# EAGLE design DigitalesSCH (EAGLE 9.6.2)
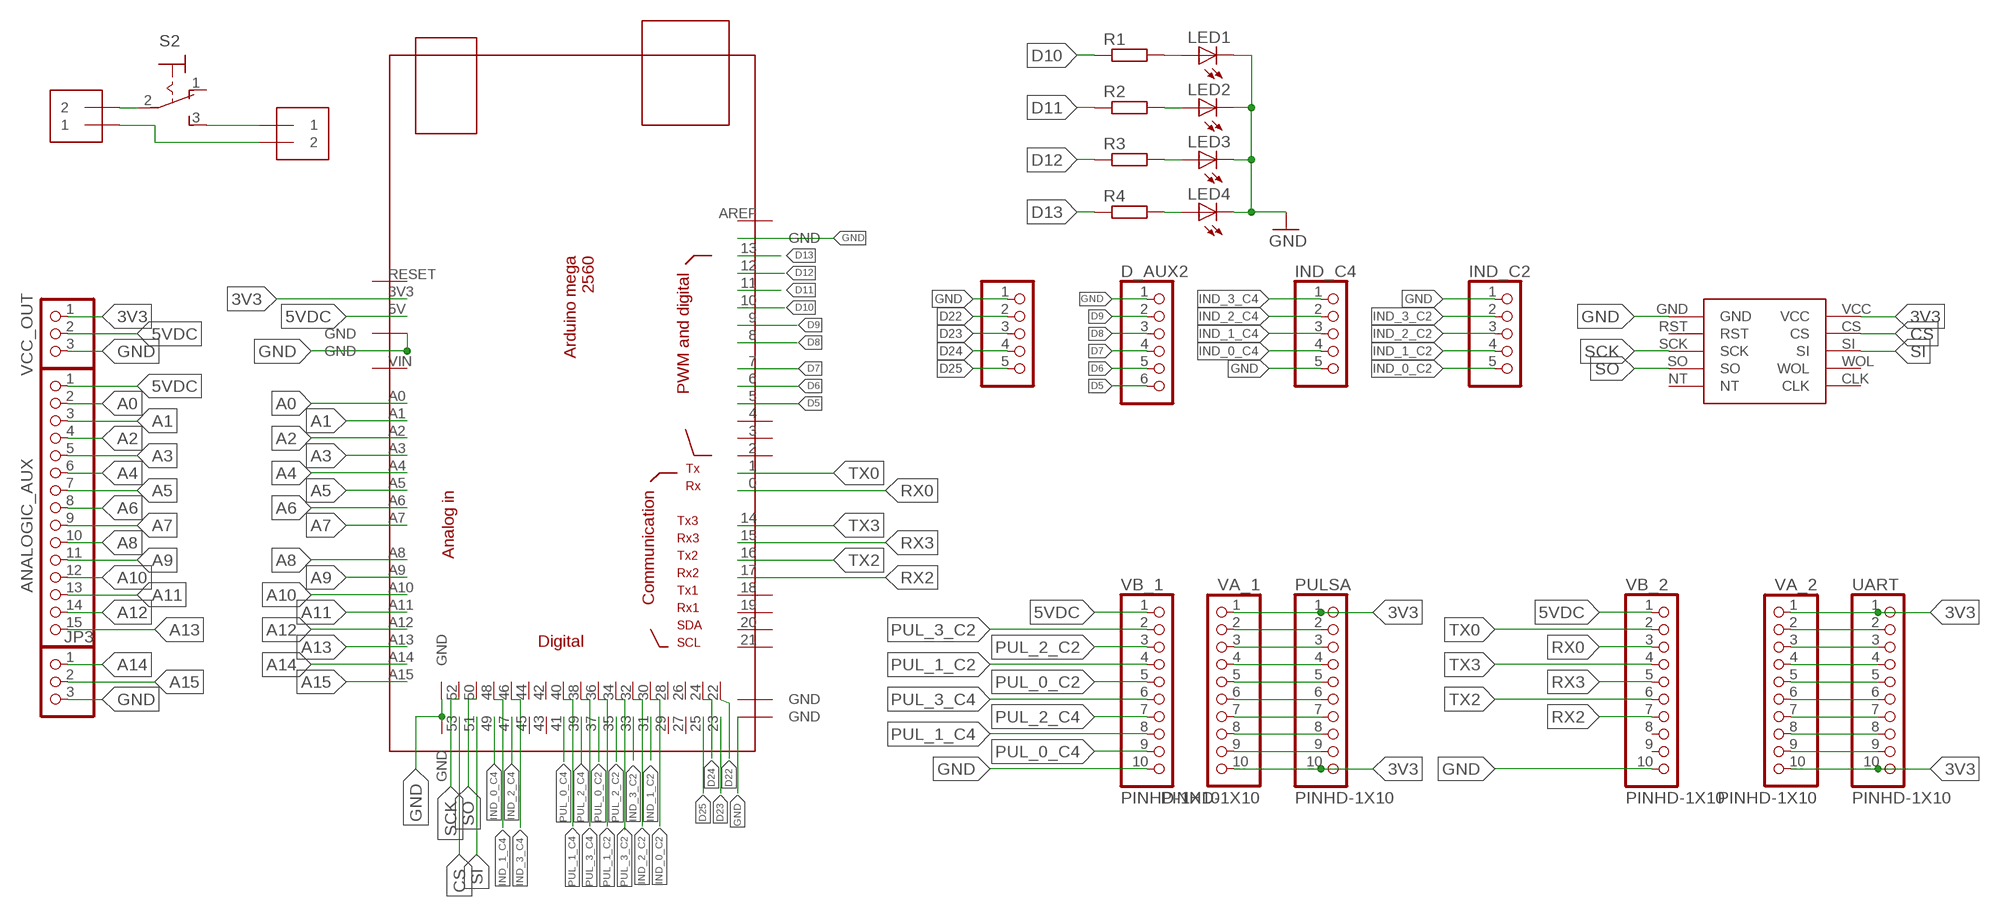
[diagram p0: schematic, sheet 1]

## Parts
ANALOGIC_AUX  PINHD-1X15  [1X15]
D_AUX1  PINHD-1X5  [1X05]
D_AUX2  PINHD-1X6  [1X06]
IND_C2  PINHD-1X5  [1X05]
IND_C4  PINHD-1X5  [1X05]
JP3  PINHD-1X3  [1X03]
LED1  LED3MM  [LED3MM]
LED2  LED3MM  [LED3MM]
LED3  LED3MM  [LED3MM]
LED4  LED3MM  [LED3MM]
PULSA  PINHD-1X10  [1X10-BIG]
R1  R-EU_M1206  [M1206]
R2  R-EU_M1206  [M1206]
R3  R-EU_M1206  [M1206]
R4  R-EU_M1206  [M1206]
S2  M9040P  [M9040P]
U$1  MEGA_DEVICE  [MEGAOUTLINE]
U$2  ENC28J60  [ENC28J60]
UART  PINHD-1X10  [1X10-BIG]
VA_1  PINHD-1X10  [1X10-BIG]
VA_2  PINHD-1X10  [1X10-BIG]
VB_1  PINHD-1X10  [1X10-BIG]
VB_2  PINHD-1X10  [1X10-BIG]
VCC_OUT  PINHD-1X3  [1X03]
VIN  1X2-3.5MM  [1X2-3.5MM]
VOUT  1X2-3.5MM  [1X2-3.5MM]

## Nets
3V3: PULSA.1 PULSA.10 U$1.3V3 U$2.VCC UART.1 UART.10 VA_1.1 VA_1.10 VA_2.1 VA_2.10 VCC_OUT.1
5VDC: ANALOGIC_AUX.1 U$1.5V VB_1.1 VB_2.1 VCC_OUT.2
A0: ANALOGIC_AUX.2 U$1.A0
A1: ANALOGIC_AUX.3 U$1.A1
A2: ANALOGIC_AUX.4 U$1.A2
A3: ANALOGIC_AUX.5 U$1.A3
A4: ANALOGIC_AUX.6 U$1.A4
A5: ANALOGIC_AUX.7 U$1.A5
A6: ANALOGIC_AUX.8 U$1.A6
A7: ANALOGIC_AUX.9 U$1.A7
A8: ANALOGIC_AUX.10 U$1.A8
A9: ANALOGIC_AUX.11 U$1.A9
A10: ANALOGIC_AUX.12 U$1.A10
A11: ANALOGIC_AUX.13 U$1.A11
A12: ANALOGIC_AUX.14 U$1.A12
A13: ANALOGIC_AUX.15 U$1.A13
A14: JP3.1 U$1.A14
A15: JP3.2 U$1.A15
CS: U$1.53 U$2.CS
D5: D_AUX2.6 U$1.5
D6: D_AUX2.5 U$1.6
D7: D_AUX2.4 U$1.7
D8: D_AUX2.3 U$1.8
D9: D_AUX2.2 U$1.9
D10: R1.1 U$1.10
D11: R2.1 U$1.11
D12: R3.1 U$1.12
D13: R4.1 U$1.13
D22: D_AUX1.2 U$1.22
D23: D_AUX1.3 U$1.23
D24: D_AUX1.4 U$1.24
D25: D_AUX1.5 U$1.25
GND: D_AUX1.1 D_AUX2.1 IND_C2.1 IND_C4.5 JP3.3 LED1.K(C) LED2.K(C) LED3.K(C) LED4.K(C) U$1.GND@1(GND) U$1.GND@2(GND) U$1.GND@3(GND) U$1.GND@5(GND) U$1.GND@6(GND) U$1.GND@7(GND) U$2.GND VB_1.10 VB_2.10 VCC_OUT.3
IND_0_C2: IND_C2.5 U$1.30
IND_0_C4: IND_C4.4 U$1.49
IND_1_C2: IND_C2.4 U$1.31
IND_1_C4: IND_C4.3 U$1.48
IND_2_C2: IND_C2.3 U$1.32
IND_2_C4: IND_C4.2 U$1.47
IND_3_C2: IND_C2.2 U$1.33
IND_3_C4: IND_C4.1 U$1.46
N$1: LED1.A R1.2
N$2: LED2.A R2.2
N$3: LED3.A R3.2
N$4: LED4.A R4.2
N$5: S2.2(P) VIN.2
N$6: PULSA.2 VA_1.2
N$7: PULSA.3 VA_1.3
N$8: PULSA.4 VA_1.4
N$9: PULSA.5 VA_1.5
N$10: PULSA.6 VA_1.6
N$11: PULSA.7 VA_1.7
N$12: PULSA.8 VA_1.8
N$13: PULSA.9 VA_1.9
N$14: S2.3(S) VOUT.1
N$15: VIN.1 VOUT.2
N$16: UART.2 VA_2.2
N$17: UART.3 VA_2.3
N$18: UART.4 VA_2.4
N$19: UART.5 VA_2.5
N$20: UART.6 VA_2.6
N$21: UART.7 VA_2.7
N$22: UART.8 VA_2.8
N$23: UART.9 VA_2.9
PUL_0_C2: U$1.37 VB_1.5
PUL_0_C4: U$1.41 VB_1.9
PUL_1_C2: U$1.36 VB_1.4
PUL_1_C4: U$1.40 VB_1.8
PUL_2_C2: U$1.35 VB_1.3
PUL_2_C4: U$1.39 VB_1.7
PUL_3_C2: U$1.34 VB_1.2
PUL_3_C4: U$1.38 VB_1.6
RX0: U$1.0 VB_2.3
RX2: U$1.17 VB_2.7
RX3: U$1.15 VB_2.5
SCK: U$1.52 U$2.SCK
SI: U$1.51 U$2.SI
SO: U$1.50 U$2.SO
TX0: U$1.1 VB_2.2
TX2: U$1.16 VB_2.6
TX3: U$1.14 VB_2.4
Unconnected: S2.1(O) U$1.2 U$1.3 U$1.4 U$1.18 U$1.19 U$1.20 U$1.21 U$1.26 U$1.27 U$1.28 U$1.29 U$1.42 U$1.43 U$1.44 U$1.45 U$1.AREF U$1.GND@4(GND) U$1.RESET U$1.VIN U$2.CLK U$2.NT U$2.RST U$2.WOL VB_2.8 VB_2.9

## Library data of the parts
ANALOGIC_AUX = adafruit:PINHD-1X15: PIN HEADER
D_AUX1 IND_C2 IND_C4 = pinhead:PINHD-1X5: PIN HEADER
D_AUX2 = adafruit:PINHD-1X6: PIN HEADER
JP3 VCC_OUT = pinhead:PINHD-1X3: PIN HEADER
LED1-LED4 = adafruit:LED: LED OSRAM: - CHIPLED LG R971, LG N971, LY N971, LG Q971, LY Q971, LO R971, LY R971 LH N974, LH R974 LS Q976, LO Q976, LY Q976 LO Q996 - Hyper CHIPLED LW Q18S LB Q993, LB Q99A, LB R99A - SideLED LS A670, LO A670, LY A670, LG A670, LP A670 LB A673, LV A673, LT A673, LW A673 LH A674 LY A675 LS A676, LA A676, LO A676, LY A676, LW A676 LS A679, LY A679, LG A679 - Hyper Micro SIDELED® LS Y876, LA Y876, LO Y876, LY Y876 LT Y87S - SmartLED LW L88C, LW L88S LB L89C, LB L89S, LG L890 LS L89K, LO L89K, LY L89K LS L896, LA L896, LO L896, LY L896 - TOPLED LS T670, LO T670, LY T670, LG T670, LP T670 LSG T670, LSP T670, LSY T670, LOP T670, LYG T670 LG T671, LOG T671, LSG T671 LB T673, LV T673, LT T673, LW T673 LH T674 LS T676, LA T676, LO T676, LY T676, LB T676, LH T676, LSB T676, LW T676 LB T67C, LV T67C, LT T67C, LS T67K, LO T67K, LY T67K, LW E67C LS E67B, LA E67B, LO E67B, LY E67B, LB E67C, LV E67C, LT E67C LW T67C LS T679, LY T679, LG T679 LS T770, LO T770, LY T770, LG T770, LP T770 LB T773, LV T773, LT T773, LW T773 LH T774 LS E675, LA E675, LY E675, LS T675 LS T776, LA T776, LO T776, LY T776, LB T776 LHGB T686 LT T68C, LB T68C - Hyper Mini TOPLED® LB M676 - Mini TOPLED Santana® LG M470 LS M47K, LO M47K, LY M47K Source: http://www.osram.convergy.de/
PULSA UART VA_1 VA_2 VB_1 VB_2 = adafruit:PINHD-1X10: Pin header 1x10 0.1" spacing With round pins
R1-R4 = rcl:R-EU_: RESISTOR, European symbol; SPICEPREFIX: R
S2 = switch:M9040P: TOGGLE SWITCH Marquardt
U$1 = ArduinoMegaOutline:MEGA_DEVICE: mega card as device
U$2 = ethernet-mikroavr:ENC28J60: ENC28J60, SHIELD EHTERNET, CREATE BY MIKROAVR.COM
VIN VOUT = adafruit:1X2: 3.5mm Terminal block http://www.ladyada.net/library/pcb/eaglelibrary.html

## Net classes
0 default: clearance 0.205 mm

## Board
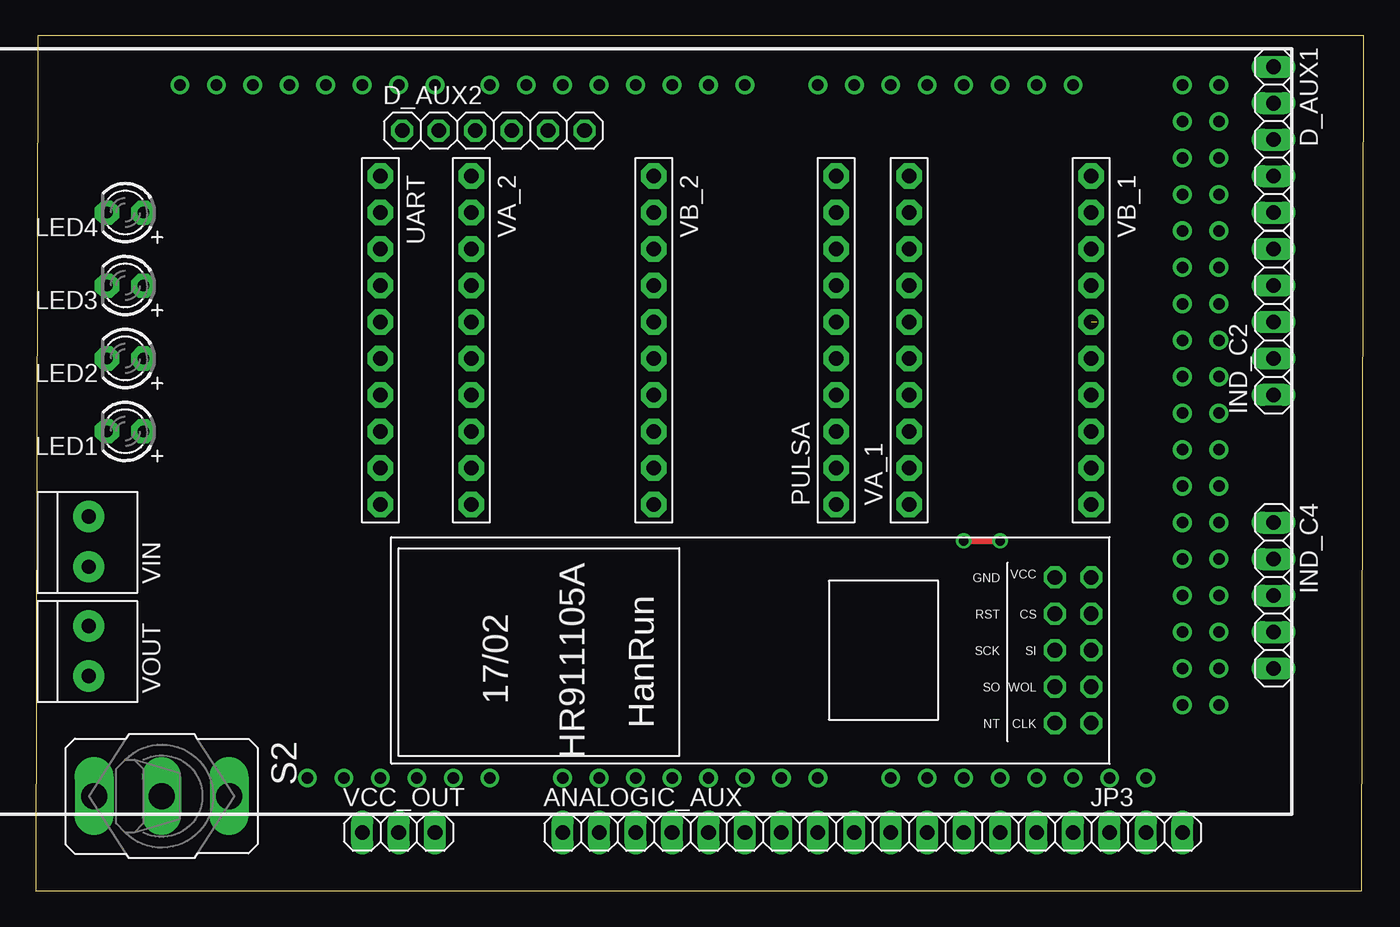
[diagram p1: board, top side]
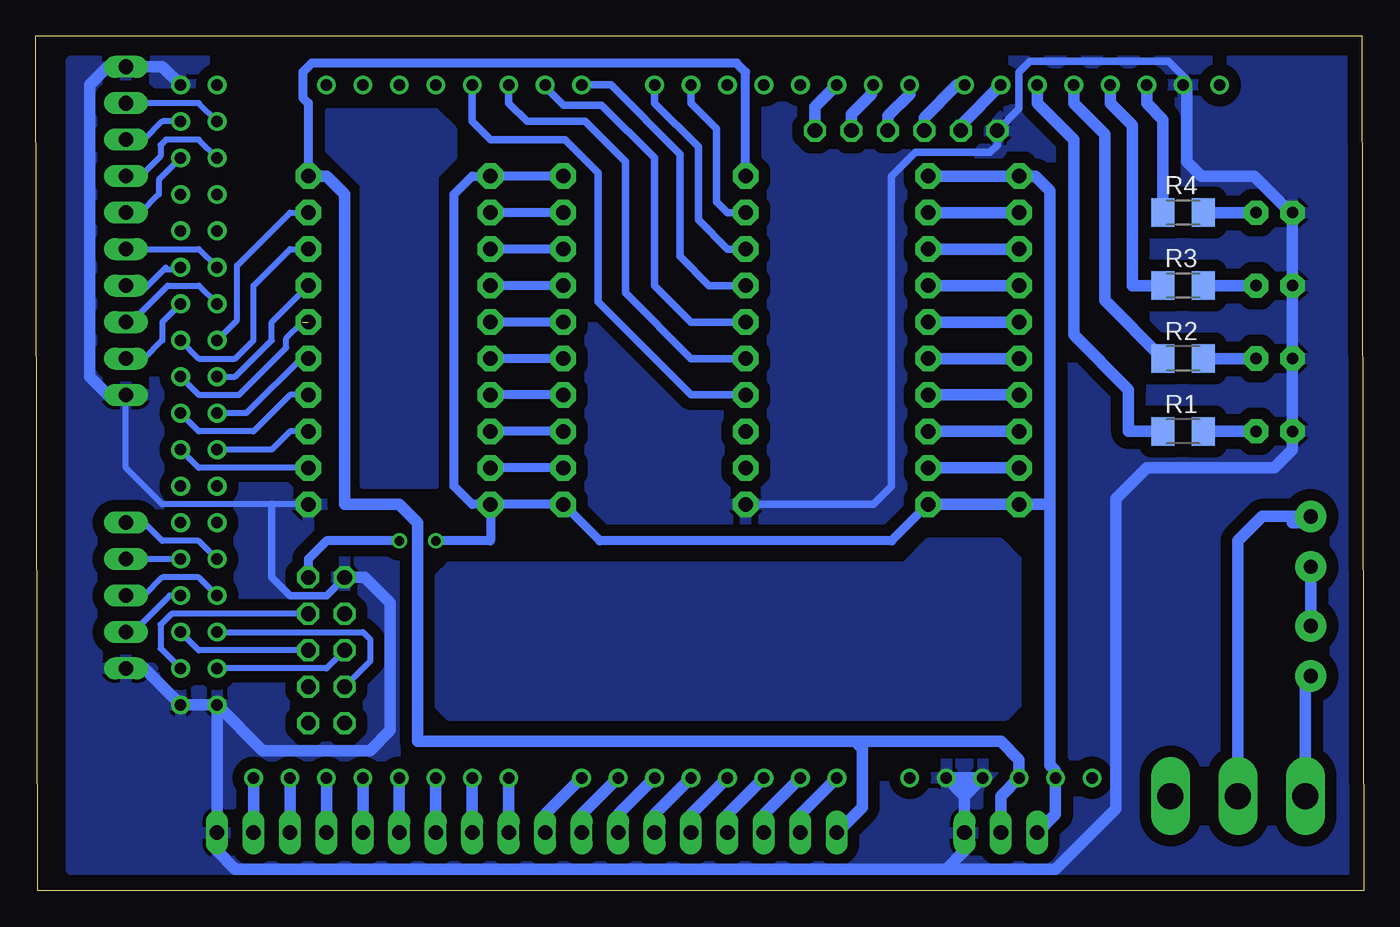
[diagram p2: board, bottom side, seen from below]

Size 92.51 x 59.55 mm. Coordinates in mm from the lower left corner, seen from the top.
Outline: 0,0 92.38,0 92.51,59.55 0.13,59.55 0,0
Copper layers (1*16): Top 0.035mm / dielectric 1.5mm / Bottom 0.035mm
Design rules "DigitalesSCH": minimum track width 6mil, minimum drill 0.35mm, track to track 0.205mm, track to pad 0.205mm, pad to pad 0.205mm, via to via 0.205mm, smd to smd 6mil, copper to edge 40mil, drill to drill 6mil, minimum pad ring 10mil, minimum via ring 8mil, stop-mask expansion 4mil, vias tented up to drill 0mil, thermal gap 10mil

### Footprints (pad centres in the part's own frame; a part is rotated, then mirrored left to right if it is on the bottom)
1X15 = drill 1.016 long: 1 -17.78,0; 2 -15.24,0; 3 -12.7,0; 4 -10.16,0; 5 -7.62,0; 6 -5.08,0; 7 -2.54,0; 8 0,0; 9 2.54,0; 10 5.08,0; 11 7.62,0; 12 10.16,0; 13 12.7,0; 14 15.24,0; 15 17.78,0
1X05 = drill 1.016 long: 1 -5.08,0; 2 -2.54,0; 3 0,0; 4 2.54,0; 5 5.08,0
1X06 = drill 1.016 octagon: 1 -6.35,0; 2 -3.81,0; 3 -1.27,0; 4 1.27,0; 5 3.81,0; 6 6.35,0
1X03 = drill 1.016 long: 1 -2.54,0; 2 0,0; 3 2.54,0
LED3MM = drill 0.813 pad 1.676 octagon: A -1.27,0; K 1.27,0
1X10-BIG = drill 1.016 pad 1.778 octagon: 1 -11.43,0; 2 -8.89,0; 3 -6.35,0; 4 -3.81,0; 5 -1.27,0; 6 1.27,0; 7 3.81,0; 8 6.35,0; 9 8.89,0; 10 11.43,0
M1206 = smd 1.6 x 2: 1 -1.4,0; 2 1.4,0
M9040P = drill 1.803 long: 1 0,4.699; 2 0,0; 3 0,-4.699
MEGAOUTLINE = drill 0.8: 0 12.7,24.13; 1 10.16,24.13; 2 7.62,24.13; 3 5.08,24.13; 3V3 -15.24,-24.13; 4 2.54,24.13; 5 0,24.13; 5V -12.7,-24.13; 6 -2.54,24.13; 7 -5.08,24.13; 8 -8.89,24.13; 9 -11.43,24.13; 10 -13.97,24.13; 11 -16.51,24.13; 12 -19.05,24.13; 13 -21.59,24.13; 14 17.78,24.13; 15 20.32,24.13; 16 22.86,24.13; 17 25.4,24.13; 18 27.94,24.13; 19 30.48,24.13; 20 33.02,24.13; 21 35.56,24.13; 22 43.18,21.59; 23 45.72,21.59; 24 43.18,19.05; 25 45.72,19.05; 26 43.18,16.51; 27 45.72,16.51; 28 43.18,13.97; 29 45.72,13.97; 30 43.18,11.43; 31 45.72,11.43; 32 43.18,8.89; 33 45.72,8.89; 34 43.18,6.35; 35 45.72,6.35; 36 43.18,3.81; 37 45.72,3.81; 38 43.18,1.27; 39 45.72,1.27; 40 43.18,-1.27; 41 45.72,-1.27; 42 43.18,-3.81; 43 45.72,-3.81; 44 43.18,-6.35; 45 45.72,-6.35; 46 43.18,-8.89; 47 45.72,-8.89; 48 43.18,-11.43; 49 45.72,-11.43; 50 43.18,-13.97; 51 45.72,-13.97; 52 43.18,-16.51; 53 45.72,-16.51; A0 0,-24.13; A1 2.54,-24.13; A2 5.08,-24.13; A3 7.62,-24.13; A4 10.16,-24.13; A5 12.7,-24.13; A6 15.24,-24.13; A7 17.78,-24.13; A8 22.86,-24.13; A9 25.4,-24.13; A10 27.94,-24.13; A11 30.48,-24.13; A12 33.02,-24.13; A13 35.56,-24.13; A14 38.1,-24.13; A15 40.64,-24.13; AREF -26.67,24.13; GND@1 -24.13,24.13; GND@2 -10.16,-24.13; GND@3 -7.62,-24.13; GND@4 43.18,24.13; GND@5 45.72,24.13; GND@6 43.18,-19.05; GND@7 45.72,-19.05; RESET -17.78,-24.13; VIN -5.08,-24.13
ENC28J60 = drill 1.016 octagon: CLK 1.27,2.54; CS 1.27,-5.08; GND 3.81,-7.62; NT 3.81,2.54; RST 3.81,-5.08; SCK 3.81,-2.54; SI 1.27,-2.54; SO 3.81,0; VCC 1.27,-7.62; WOL 1.27,0
1X2-3.5MM = drill 1 pad 2.184: 1 1.8,0; 2 -1.7,0

### Placement (x,y rotation side)
ANALOGIC_AUX  54.48,4.06 0 top
D_AUX1  86.23,52.32 270 top
D_AUX2  31.88,52.96 0 top
IND_C2  86.23,39.62 90 top
IND_C4  86.23,20.57 270 top
JP3  77.34,4.06 0 top
LED1  6.22,32 180 top
LED2  6.22,37.08 180 top
LED3  6.22,42.16 180 top
LED4  6.22,47.24 180 top
PULSA  55.75,38.35 90 top
R1  12.57,32 0 bottom
R2  12.57,37.08 0 bottom
R3  12.57,42.16 0 bottom
R4  12.57,47.24 0 bottom
S2  8.76,6.6 270 top
U$1  36.7,32 0 top
U$2  74.8,14.22 180 top
UART  24,38.35 270 top
VA_1  60.83,38.35 90 top
VA_2  30.35,38.35 270 top
VB_1  73.53,38.35 270 top
VB_2  43.05,38.35 270 top
VCC_OUT  25.27,4.06 0 top
VIN  3.68,24.38 270 top
VOUT  3.68,16.76 270 top

### Tracks (layer width: path | path; a pad name or v marks a point on that pad's centre or on a via)
3V3  (via drill 0.65 pad 0.55)
  Top 0.406: v64.64,24.38 v67.18,24.38
  Bottom 0.61: VA_2.10 32.89,24.38 53.21,24.38 PULSA.1 VA_1.1 | VA_1.1 62.1,26.92 63.37,28.19 63.37,48.51 62.1,49.78 VA_1.10 PULSA.10 | VA_1.1 60.83,24.38 v64.64,24.38 | U$2.VCC 73.53,23.11 72.26,24.38 v67.18,24.38
  Bottom 0.813: 21.84,26.92 21.84,48.77 22.86,49.78 UART.1 VA_2.1 | 21.84,26.92 21.84,8.76 21.46,8.38 U$1.3V3 21.46,5.33 VCC_OUT.1 | 21.84,26.92 UART.10 VA_2.10
5VDC
  Bottom 0.61: VB_2.1 43.05,57.02 43.69,57.66 73.28,57.66 73.91,57.02 73.91,55.25 73.53,54.86 VB_1.1
  Bottom 0.813: VCC_OUT.2 25.27,6.6 U$1.5V 24,9.14 25.27,10.41 35.43,10.41 | VB_1.1 72.26,49.78 70.99,48.51 70.99,26.92 67.18,26.92 65.91,25.65 65.91,10.41 35.43,10.41 | ANALOGIC_AUX.1 34.93,5.84 34.93,9.91 35.43,10.41
A0
  Bottom 0.813: U$1.A0 39.24,5.33 ANALOGIC_AUX.2
A1
  Bottom 0.813: U$1.A1 41.78,5.33 ANALOGIC_AUX.3
A2
  Bottom 0.813: U$1.A2 44.32,5.33 ANALOGIC_AUX.4
A3
  Bottom 0.813: U$1.A3 46.86,5.33 ANALOGIC_AUX.5
A4
  Bottom 0.813: U$1.A4 49.4,5.33 ANALOGIC_AUX.6
A5
  Bottom 0.813: U$1.A5 51.94,5.33 ANALOGIC_AUX.7
A6
  Bottom 0.813: U$1.A6 54.48,5.33 ANALOGIC_AUX.8
A7
  Bottom 0.813: U$1.A7 57.02,5.33 ANALOGIC_AUX.9
A8
  Bottom 0.813: U$1.A8 ANALOGIC_AUX.10
A9
  Bottom 0.813: U$1.A9 ANALOGIC_AUX.11
A10
  Bottom 0.813: U$1.A10 ANALOGIC_AUX.12
A11
  Bottom 0.813: U$1.A11 ANALOGIC_AUX.13
A12
  Bottom 0.813: U$1.A12 ANALOGIC_AUX.14
A13
  Bottom 0.813: U$1.A13 ANALOGIC_AUX.15
A14
  Bottom 0.813: U$1.A14 JP3.1
A15
  Bottom 0.813: U$1.A15 JP3.2
AA0
  pour Bottom: 24,12.95 24,23.11 25.27,24.38 30.35,24.38 32,22.73 63.75,22.73 64.52,21.97 64.52,12.83 63.75,12.06 24.89,12.06
AA1
  pour Bottom: 64.64,28.19 69.72,28.19 69.72,48.51 69.72,49.15 72.14,51.56 72.14,54.36 64.64,54.36 63.37,53.09 63.37,51.05 64.64,49.78
CS
  Bottom 0.406: U$1.53 83.82,16.89 83.82,18.54 83.06,19.3 U$2.CS
D5
  Bottom 0.813: U$1.5 38.23,54.61 D_AUX2.6
D6
  Bottom 0.813: U$1.6 34.29,56.01 34.29,55.5 35.69,54.1 D_AUX2.5
D7
  Bottom 0.813: D_AUX2.4 33.15,53.98 31.62,55.5 U$1.7
D8
  Bottom 0.813: U$1.8 28.32,56.13 30.61,53.85 D_AUX2.3
D9
  Bottom 0.813: U$1.9 28.07,53.34 D_AUX2.2
D10
  Bottom 0.813: R1.1 16.38,32 16.38,34.93 20.19,38.73 20.19,52.32 22.73,54.86 U$1.10
D11
  Bottom 0.813: R2.1 18.03,41.15 18.03,52.7 20.19,54.86 U$1.11
D12
  Bottom 0.813: R3.1 16.13,42.16 16.13,53.34 17.65,54.86 U$1.12
D13
  Bottom 0.813: R4.1 13.97,53.72 15.11,54.86 U$1.13
D22
  Bottom 0.406: U$1.22 81.15,54.86 D_AUX1.2
D23
  Bottom 0.406: U$1.23 83.69,53.59 84.96,52.32 D_AUX1.3
D24
  Bottom 0.406: U$1.24 81.15,52.32 83.44,52.32 83.82,51.94 83.82,51.18 85.22,49.78 D_AUX1.4
D25
  Bottom 0.406: D_AUX1.5 85.22,47.24 83.95,48.51 83.95,49.53 U$1.25
GND
  Bottom 0.406: VB_1.10 76.07,26.92 83.69,26.92 86.23,29.46 IND_C2.1
  Bottom 0.508: U$2.GND 72.26,20.57 74.8,20.57 76.07,21.84 76.07,26.92 | VB_2.10 34.16,26.92 32.89,28.19 32.89,49.78 31.24,51.44 26.04,51.44 25.53,51.94 D_AUX2.1 24,54.48 24,57.02 23.24,57.79 13.59,57.79 12.32,56.52 12.32,55.88
  Bottom 0.813: VCC_OUT.3 27.81,5.33 | 27.81,7.87 U$1.GND@2 27.81,6.6 | 27.81,7.87 U$1.GND@3 27.81,6.6 | VCC_OUT.3 27.81,6.6 | 27.81,6.6 27.81,7.87 | U$2.GND 69.6,21.84 67.82,20.07 67.82,11.18 69.22,9.78 76.71,9.78 U$1.GND@6 | U$1.GND@6 U$1.GND@7 84.96,15.49 IND_C4.5 | U$1.GND@6 JP3.3 79.88,2.79 78.61,1.52 29.08,1.52 | VCC_OUT.3 27.81,2.79 29.08,1.52 | U$1.GND@1 12.32,55.88 12.32,50.8 11.3,49.78 7.62,49.78 5.08,47.24 LED4.K LED3.K LED2.K LED1.K 4.95,30.73 6.22,29.46 15.11,29.46 17.27,27.3 17.27,5.71 21.46,1.52 29.08,1.52 | IND_C2.1 87.5,34.54 88.77,35.81 88.77,56.13 87.5,57.4 D_AUX1.1 83.69,57.4 U$1.GND@5
  pour Bottom (isolate 0.813): 1.14,57.79 90.04,57.79 90.04,1.52 1.14,1.52
IND_0_C2
  Bottom 0.406: IND_C2.5 81.15,44.7 U$1.30
IND_0_C4
  Bottom 0.406: IND_C4.4 85.73,18.03 83.19,20.57 U$1.49
IND_1_C2
  Bottom 0.406: 83.44,43.43 83.57,43.31 | 83.57,43.31 84.84,42.04 86.11,42.04 IND_C2.4 | 83.57,43.31 82.55,43.31 U$1.31
IND_1_C4
  Bottom 0.406: IND_C4.3 84.96,20.57 83.69,21.84 81.15,21.84 U$1.48
IND_2_C2
  Bottom 0.406: IND_C2.3 85.6,39.62 85.6,39.88 83.31,42.16 81.15,42.16 U$1.32
IND_2_C4
  Bottom 0.406: U$1.47 IND_C4.2
IND_3_C2
  Bottom 0.406: IND_C2.2 84.96,37.08 83.69,38.35 83.69,39.62 U$1.33
IND_3_C4
  Bottom 0.406: IND_C4.1 84.96,25.65 83.69,24.38 81.15,24.38 U$1.46
N$1
  Bottom 0.813: R1.2 LED1.A
N$2
  Bottom 0.813: R2.2 LED2.A
N$3
  Bottom 0.813: R3.2 LED3.A
N$4
  Bottom 0.813: R4.2 LED4.A
N$5
  Bottom 0.813: 4.95,25.65 4.11,25.65 VIN.2 7.06,26.08 8.76,24.38 S2.2
N$6
  Bottom 0.61: PULSA.2 VA_1.2
N$7
  Bottom 0.61: PULSA.3 VA_1.3
N$8
  Bottom 0.61: PULSA.4 VA_1.4
N$9
  Bottom 0.61: PULSA.5 VA_1.5
N$10
  Bottom 0.61: PULSA.6 VA_1.6
N$11
  Bottom 0.61: PULSA.7 VA_1.7
N$12
  Bottom 0.61: PULSA.8 VA_1.8
N$13
  Bottom 0.61: PULSA.9 VA_1.9
N$14
  Bottom 0.813: VOUT.1 4.06,14.58 S2.3
N$15
  Bottom 0.813: VIN.1 VOUT.2
N$16
  Bottom 0.813: UART.2 VA_2.2
N$17
  Bottom 0.813: UART.3 VA_2.3
N$18
  Bottom 0.813: UART.4 VA_2.4
N$19
  Bottom 0.813: UART.5 VA_2.5
N$20
  Bottom 0.813: UART.6 VA_2.6
N$21
  Bottom 0.813: UART.7 VA_2.7
N$22
  Bottom 0.813: UART.8 VA_2.8
N$23
  Bottom 0.813: UART.9 VA_2.9
PUL_0_C2  (1 unrouted)
  Bottom 0.406: U$1.37 81.15,34.54 78.36,34.54 75.06,37.85 75.06,38.48 73.91,39.62
PUL_0_C4
  Bottom 0.406: VB_1.9 81.15,29.46 U$1.41
PUL_1_C2
  Bottom 0.406: U$1.36 78.61,35.81 76.07,38.35 76.07,39.62 VB_1.4
PUL_1_C4
  Bottom 0.406: VB_1.8 74.8,32 76.07,30.73 U$1.40
PUL_2_C2
  Bottom 0.406: U$1.35 81.15,37.08 78.61,37.08 77.34,38.35 77.34,42.16 74.8,44.7 VB_1.3
PUL_2_C4
  Bottom 0.406: VB_1.7 74.8,34.54 77.34,32 81.15,32 U$1.39
PUL_3_C2
  Bottom 0.406: U$1.34 78.49,39.75 78.49,43.56 74.8,47.24 VB_1.2
PUL_3_C4
  Bottom 0.406: VB_1.6 74.04,37.08 77.6,33.53 77.85,33.27 U$1.38
RX0
  Bottom 0.508: U$1.0 49.4,54.86 46.36,51.82 46.36,46.74 44.32,44.7 VB_2.3
RX2
  Bottom 0.508: VB_2.7 46.86,34.54 53.34,41.02 53.34,50.04 55.63,52.32 60.83,52.32 62.1,53.59 U$1.17
RX3
  Bottom 0.508: VB_2.5 46.86,39.62 49.4,42.16 49.4,51.05 53.09,54.74 55.75,54.74 57.02,56.01 U$1.15
SCK
  Bottom 0.406: U$2.SCK 72.26,15.49 U$1.52
SI
  Bottom 0.406: U$2.SI 81.15,16.76 U$1.51
SO
  Bottom 0.406: U$2.SO 69.22,16 69.22,17.53 69.72,18.03 U$1.50
TX0
  Bottom 0.508: VB_2.2 44.32,47.24 45.09,48.01 45.09,53.09 46.86,54.86 U$1.1
TX2
  Bottom 0.508: VB_2.6 46.86,37.08 51.44,41.66 51.44,50.8 54.23,53.59 58.29,53.59 59.56,54.86 U$1.16
TX3
  Bottom 0.508: VB_2.4 45.59,42.16 47.62,44.2 47.62,51.31 52.45,56.13 U$1.14